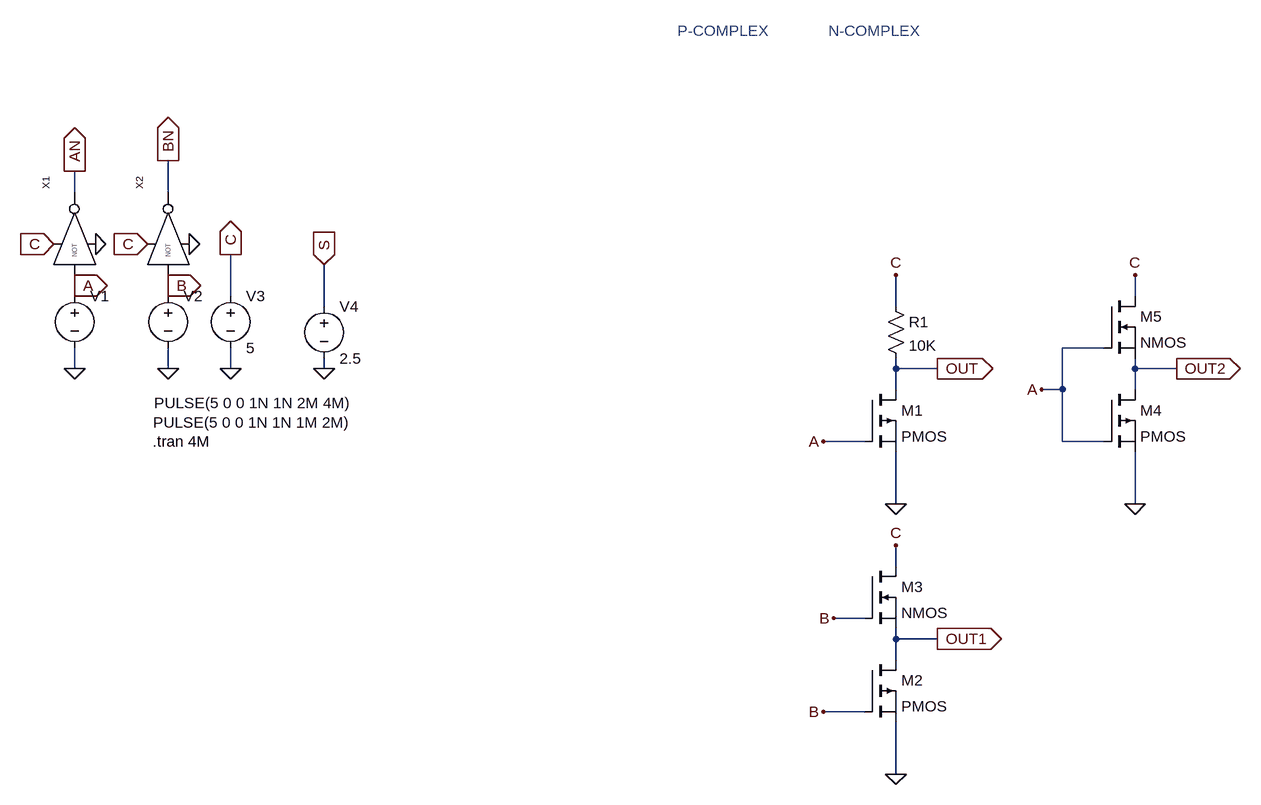
[diagram p0: schematic SACMALIK.asc]
SACMALIK.asc, the LTspice schematic file:
Version 4
SHEET 1 1692 756
WIRE -128 -160 -128 -192
WIRE 16 -160 16 -208
WIRE -128 -16 -128 -32
WIRE 16 -16 16 -32
WIRE -128 0 -128 -16
WIRE 16 0 16 -16
WIRE 112 0 112 -64
WIRE 1504 0 1504 -32
WIRE 256 16 256 -48
WIRE 1136 16 1136 -32
WIRE 1456 80 1392 80
WIRE -128 112 -128 80
WIRE 16 112 16 80
WIRE 112 112 112 80
WIRE 256 112 256 96
WIRE 1136 112 1136 96
WIRE 1200 112 1136 112
WIRE 1504 112 1504 96
WIRE 1568 112 1504 112
WIRE 1136 144 1136 112
WIRE 1392 144 1392 80
WIRE 1392 144 1360 144
WIRE 1504 144 1504 112
WIRE 1088 224 1024 224
WIRE 1392 224 1392 144
WIRE 1456 224 1392 224
WIRE 1136 320 1136 240
WIRE 1504 320 1504 240
WIRE 1136 416 1136 384
WIRE 1088 496 1040 496
WIRE 1136 528 1136 512
WIRE 1200 528 1136 528
WIRE 1136 560 1136 528
WIRE 1088 640 1024 640
WIRE 1136 736 1136 656
FLAG 112 -64 C
IOPIN 112 -64 Out
FLAG 112 112 0
FLAG 16 112 0
FLAG -128 112 0
FLAG 48 -80 0
FLAG -96 -80 0
FLAG -128 -192 AN
IOPIN -128 -192 Out
FLAG 16 -208 BN
IOPIN 16 -208 Out
FLAG -16 -80 C
IOPIN -16 -80 In
FLAG -160 -80 C
IOPIN -160 -80 In
FLAG -128 -16 A
IOPIN -128 -16 Out
FLAG 16 -16 B
IOPIN 16 -16 Out
FLAG 1136 320 0
FLAG 1024 224 A
FLAG 1136 -32 C
FLAG 1200 112 OUT
IOPIN 1200 112 Out
FLAG 1136 736 0
FLAG 1024 640 B
FLAG 1136 384 C
FLAG 1200 528 OUT1
IOPIN 1200 528 Out
FLAG 1040 496 B
FLAG 1504 320 0
FLAG 1504 -32 C
FLAG 1568 112 OUT2
IOPIN 1568 112 Out
FLAG 1360 144 A
FLAG 256 112 0
FLAG 256 -48 S
IOPIN 256 -48 In
SYMBOL voltage -128 -16 R0
WINDOW 3 122 181 Left 2
WINDOW 123 0 0 Left 0
WINDOW 39 0 0 Left 0
SYMATTR Value PULSE(5 0 0 1N 1N 2M 4M)
SYMATTR InstName V1
SYMBOL voltage 16 -16 R0
WINDOW 3 -23 211 Left 2
WINDOW 123 0 0 Left 0
WINDOW 39 0 0 Left 0
SYMATTR Value PULSE(5 0 0 1N 1N 1M 2M)
SYMATTR InstName V2
SYMBOL voltage 112 -16 R0
WINDOW 123 0 0 Left 0
WINDOW 39 0 0 Left 0
SYMATTR InstName V3
SYMATTR Value 5
SYMBOL NOT4 -112 -96 R270
SYMATTR InstName X1
SYMBOL NOT4 32 -96 R270
SYMATTR InstName X2
SYMBOL pmos 1088 144 R0
SYMATTR InstName M1
SYMBOL res 1120 0 R0
SYMATTR InstName R1
SYMATTR Value 10K
SYMBOL pmos 1088 560 R0
SYMATTR InstName M2
SYMBOL nmos 1088 416 R0
SYMATTR InstName M3
SYMBOL pmos 1456 144 R0
SYMATTR InstName M4
SYMBOL nmos 1456 0 R0
SYMATTR InstName M5
SYMBOL voltage 256 0 R0
WINDOW 123 0 0 Left 0
WINDOW 39 0 0 Left 0
SYMATTR InstName V4
SYMATTR Value 2.5
TEXT -8 224 Left 2 !.tran 4M
TEXT 800 -408 Left 2 ;P-COMPLEX
TEXT 1032 -408 Left 2 ;N-COMPLEX

The netlist it stands for:
* SACMALIK.asc
V1 A 0 PULSE(5 0 0 1N 1N 2M 4M)
V2 B 0 PULSE(5 0 0 1N 1N 1M 2M)
V3 C 0 5
XX1 A C 0 AN NOT4  ; pins A VH VL OUT
XX2 B C 0 BN NOT4  ; pins A VH VL OUT
M1 OUT A 0 0 PMOS
R1 C OUT 10K
M2 OUT1 B 0 0 PMOS
M3 C B OUT1 OUT1 NMOS
M4 OUT2 A 0 0 PMOS
M5 C A OUT2 OUT2 NMOS
V4 S 0 2.5
.model NMOS NMOS
.model PMOS PMOS
.lib standard.mos
.tran 4M
* P-COMPLEX
* N-COMPLEX
.backanno
.end